# Altium project PM_Drive_UI.PrjPcb
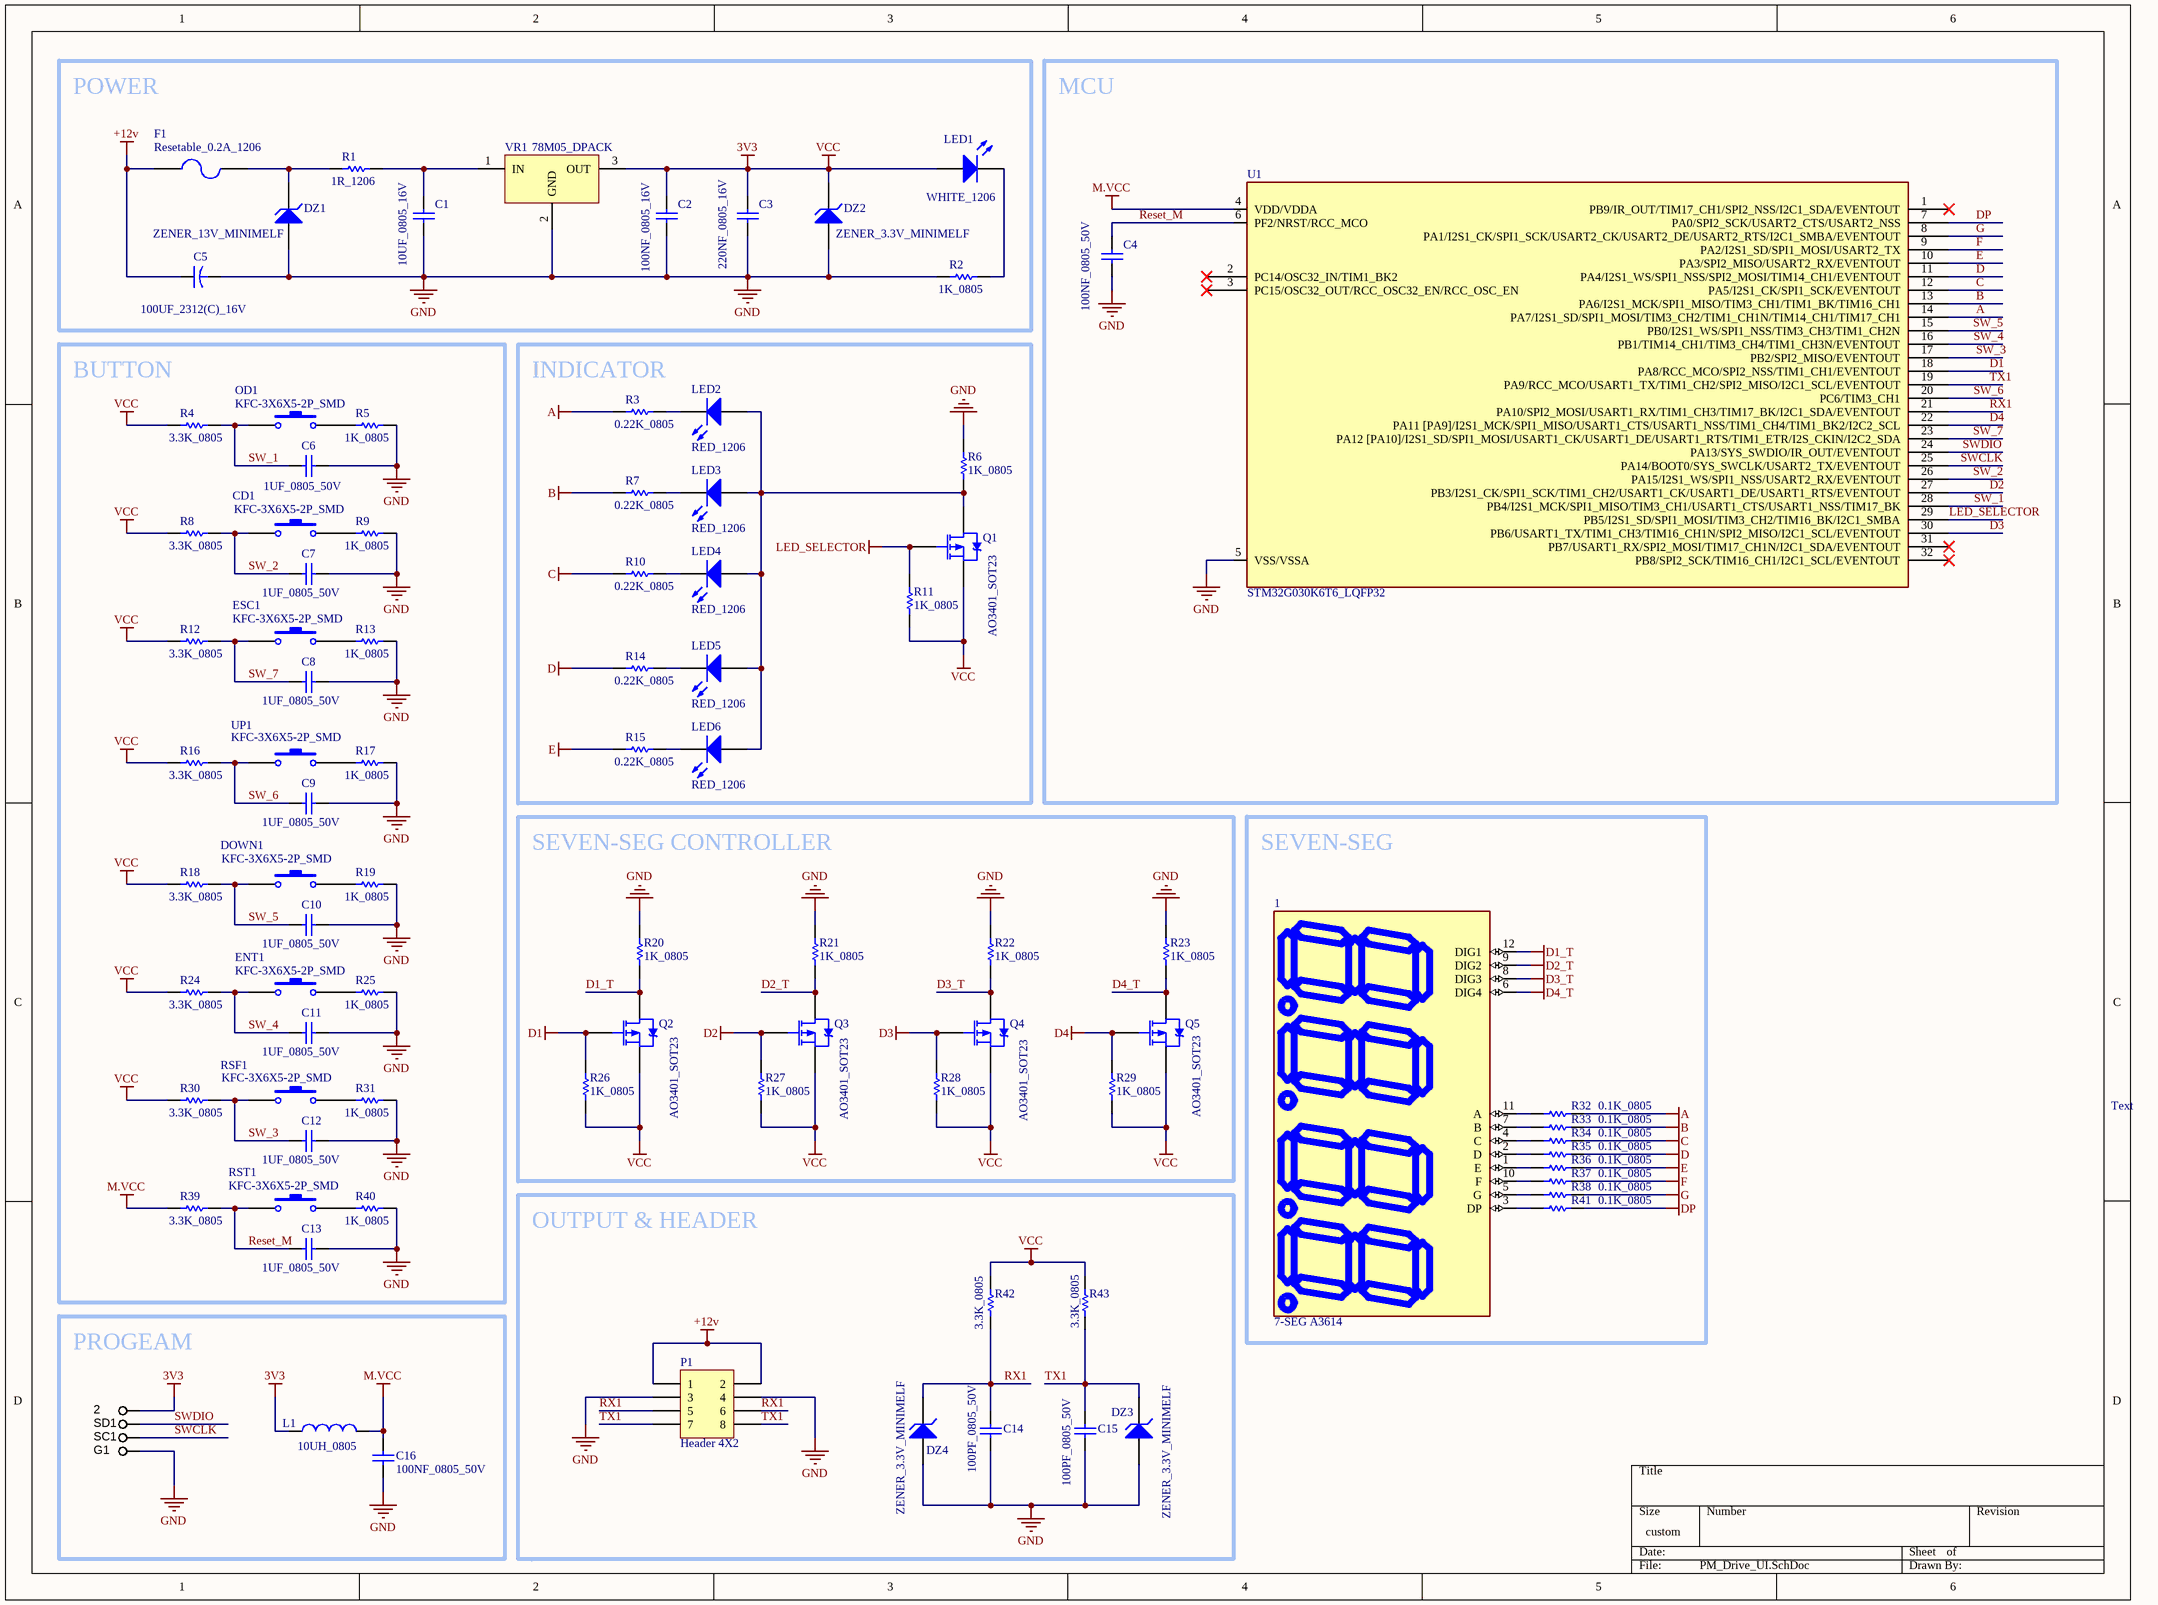
[diagram p0: PM_Drive_UI.SchDoc]
1 sheet, 92 parts. Net scope: global (net labels, ports and power ports of the same name join across sheets).
Board file: PM_Drive_UI.PcbDoc

## Sheet PM_Drive_UI.SchDoc: PM_Drive_UI
size 400 x 299 mm; Date: 1402/01/18; DrawnBy: Amirreza Salehpour

### Parts
1  7-SEG A3614  [7Seg_4Digit]
2  (no value)  [TPSMD_D1]  (net tie, no BOM)
C1  10UF_0805_16V  [Cap_0805_Nominal]
C2  100NF_0805_16V  [Cap_0805_Nominal]
C3  220NF_0805_16V  [Cap_0805_Nominal]
C4  100NF_0805_50V  [Cap_0805_Nominal]
C5  100UF_2312(C)_16V  [Cap_Tantal(6032)_C]
C6  1UF_0805_50V  [Cap_0805_Nominal]
C7  1UF_0805_50V  [Cap_0805_Nominal]
C8  1UF_0805_50V  [Cap_0805_Nominal]
C9  1UF_0805_50V  [Cap_0805_Nominal]
C10  1UF_0805_50V  [Cap_0805_Nominal]
C11  1UF_0805_50V  [Cap_0805_Nominal]
C12  1UF_0805_50V  [Cap_0805_Nominal]
C13  1UF_0805_50V  [Cap_0805_Nominal]
C14  100PF_0805_50V  [Cap_0805_Nominal]
C15  100PF_0805_50V  [Cap_0805_Nominal]
C16  100NF_0805_50V  [Cap_0805_Nominal]
CD1  KFC-3X6X5-2P_SMD  [SWPBS_SPST_6X3X5]
DOWN1  KFC-3X6X5-2P_SMD  [SWPBS_SPST_6X3X5]
DZ1  ZENER_13V_MINIMELF  [Diode_ZENER_MINIMELF]
DZ2  ZENER_3.3V_MINIMELF  [Diode_ZENER_MINIMELF]
DZ3  ZENER_3.3V_MINIMELF  [Diode_ZENER_MINIMELF]
DZ4  ZENER_3.3V_MINIMELF  [Diode_ZENER_MINIMELF]
ENT1  KFC-3X6X5-2P_SMD  [SWPBS_SPST_6X3X5]
ESC1  KFC-3X6X5-2P_SMD  [SWPBS_SPST_6X3X5]
F1  Resetable_0.2A_1206  [FUSE_1206]
G1  (no value)  [TPSMD_D1]  (net tie, no BOM)
L1  10UH_0805  [INDUCTOR_0805_Nominal]
LED1  WHITE_1206  [LED_1206_NOMINAL]
LED2  RED_1206  [LED_1206_NOMINAL]
LED3  RED_1206  [LED_1206_NOMINAL]
LED4  RED_1206  [LED_1206_NOMINAL]
LED5  RED_1206  [LED_1206_NOMINAL]
LED6  RED_1206  [LED_1206_NOMINAL]
OD1  KFC-3X6X5-2P_SMD  [SWPBS_SPST_6X3X5]
P1  Header 4X2  [HDR_M_2X4_2.54MM]
Q1  AO3401_SOT23  [SOT23_MOSFET]
Q2  AO3401_SOT23  [SOT23_MOSFET]
Q3  AO3401_SOT23  [SOT23_MOSFET]
Q4  AO3401_SOT23  [SOT23_MOSFET]
Q5  AO3401_SOT23  [SOT23_MOSFET]
R1  1R_1206  [Res_1206_BIG SIZE]
R2  1K_0805  [Res_0805_Nominal]
R3  0.22K_0805  [Res_0805_Nominal]
R4  3.3K_0805  [Res_0805_Nominal]
R5  1K_0805  [Res_0805_Nominal]
R6  1K_0805  [Res_0805_Nominal]
R7  0.22K_0805  [Res_0805_Nominal]
R8  3.3K_0805  [Res_0805_Nominal]
R9  1K_0805  [Res_0805_Nominal]
R10  0.22K_0805  [Res_0805_Nominal]
R11  1K_0805  [Res_0805_Nominal]
R12  3.3K_0805  [Res_0805_Nominal]
R13  1K_0805  [Res_0805_Nominal]
R14  0.22K_0805  [Res_0805_Nominal]
R15  0.22K_0805  [Res_0805_Nominal]
R16  3.3K_0805  [Res_0805_Nominal]
R17  1K_0805  [Res_0805_Nominal]
R18  3.3K_0805  [Res_0805_Nominal]
R19  1K_0805  [Res_0805_Nominal]
R20  1K_0805  [Res_0805_Nominal]
R21  1K_0805  [Res_0805_Nominal]
R22  1K_0805  [Res_0805_Nominal]
R23  1K_0805  [Res_0805_Nominal]
R24  3.3K_0805  [Res_0805_Nominal]
R25  1K_0805  [Res_0805_Nominal]
R26  1K_0805  [Res_0805_Nominal]
R27  1K_0805  [Res_0805_Nominal]
R28  1K_0805  [Res_0805_Nominal]
R29  1K_0805  [Res_0805_Nominal]
R30  3.3K_0805  [Res_0805_Nominal]
R31  1K_0805  [Res_0805_Nominal]
R32  0.1K_0805  [Res_0805_Nominal]
R33  0.1K_0805  [Res_0805_Nominal]
R34  0.1K_0805  [Res_0805_Nominal]
R35  0.1K_0805  [Res_0805_Nominal]
R36  0.1K_0805  [Res_0805_Nominal]
R37  0.1K_0805  [Res_0805_Nominal]
R38  0.1K_0805  [Res_0805_Nominal]
R39  3.3K_0805  [Res_0805_Nominal]
R40  1K_0805  [Res_0805_Nominal]
R41  0.1K_0805  [Res_0805_Nominal]
R42  3.3K_0805  [Res_0805_Nominal]
R43  3.3K_0805  [Res_0805_Nominal]
RSF1  KFC-3X6X5-2P_SMD  [SWPBS_SPST_6X3X5]
RST1  KFC-3X6X5-2P_SMD  [SWPBS_SPST_6X3X5]
SC1  (no value)  [TPSMD_D1]  (net tie, no BOM)
SD1  (no value)  [TPSMD_D1]  (net tie, no BOM)
U1  STM32G030K6T6_LQFP32  [QFG80_32]
UP1  KFC-3X6X5-2P_SMD  [SWPBS_SPST_6X3X5]
VR1  78M05_DPACK  [DPAK]

### Blocks framed on the sheet
POWER: C1-C3 C5 DZ1 DZ2 F1 LED1 R1 R2 VR1
MCU: C4 U1
BUTTON: C6-C13 CD1 DOWN1 ENT1 ESC1 OD1 R4 R5 R8 R9 R12 R13 R16-R19 R24 R25 R30 R31 R39 R40 RSF1 RST1 UP1
INDICATOR: LED2-LED6 Q1 R3 R6 R7 R10 R11 R14 R15
SEVEN-SEG CONTROLLER: Q2-Q5 R20-R23 R26-R29
SEVEN-SEG: 1 R32-R38 R41
OUTPUT & HEADER: C14 C15 DZ3 DZ4 P1 R42 R43
PROGEAM: 2 C16 G1 L1 SC1 SD1

### Nets
3V3: 2.1 C2.2 C3.2 DZ2.2(K) L1.1 LED1.1(A) Q1.2(S) Q2.2(S) Q3.2(S) Q4.2(S) Q5.2(S) R4.1 R8.1 R11.1 R12.1 R16.1 R18.1 R24.1 R26.1 R27.1 R28.1 R29.1 R30.1 R42.2 R43.2 VR1.3(OUT)  [also labelled VCC]
+12v: C5.1 F1.1 P1.1 P1.2
A: R3.1 R32.2 U1.14(PA7/I2S1_SD/SPI1_MOSI/TIM3_CH2/TIM1_CH1N/TIM14_CH1/TIM17_CH1)
B: R7.1 R33.2 U1.13(PA6/I2S1_MCK/SPI1_MISO/TIM3_CH1/TIM1_BK/TIM16_CH1)
C: R10.1 R34.1 U1.12(PA5/I2S1_CK/SPI1_SCK/EVENTOUT)
D: R14.1 R35.1 U1.11(PA4/I2S1_WS/SPI1_NSS/SPI2_MOSI/TIM14_CH1/EVENTOUT)
D1: Q2.1(G) R26.2 U1.18(PA8/RCC_MCO/SPI2_NSS/TIM1_CH1/EVENTOUT)
D1_T: 1.12(DIG1) Q2.3(D) R20.1
D2: Q3.1(G) R27.2 U1.27(PB3/I2S1_CK/SPI1_SCK/TIM1_CH2/USART1_CK/USART1_DE/USART1_RTS/EVENTOUT)
D2_T: 1.9(DIG2) Q3.3(D) R21.1
D3: Q4.1(G) R28.2 U1.30(PB6/USART1_TX/TIM1_CH3/TIM16_CH1N/SPI2_MISO/I2C1_SCL/EVENTOUT)
D3_T: 1.8(DIG3) Q4.3(D) R22.1
D4: Q5.1(G) R29.2 U1.22(PA11_[PA9]/I2S1_MCK/SPI1_MISO/USART1_CTS/USART1_NSS/TIM1_CH4/TIM1_BK2/I2C2_SCL)
D4_T: 1.6(DIG4) Q5.3(D) R23.1
DP: R41.1 U1.7(PA0/SPI2_SCK/USART2_CTS/USART2_NSS)
E: R15.1 R36.1 U1.10(PA3/SPI2_MISO/USART2_RX/EVENTOUT)
F: R37.2 U1.9(PA2/I2S1_SD/SPI1_MOSI/USART2_TX)
G: R38.1 U1.8(PA1/I2S1_CK/SPI1_SCK/USART2_CK/USART2_DE/USART2_RTS/I2C1_SMBA/EVENTOUT)
GND: C1.1 C2.1 C3.1 C4.1 C5.2 C6.1 C7.1 C8.1 C9.1 C10.1 C11.1 C12.1 C13.1 C14.2 C15.2 C16.2 DZ1.1(A) DZ2.1(A) DZ3.1(A) DZ4.1(A) G1.1 P1.3 P1.4 R2.1 R5.2 R6.2 R9.2 R13.2 R17.2 R19.2 R20.2 R21.2 R22.2 R23.2 R25.2 R31.2 R40.2 U1.5(VSS/VSSA) VR1.2(GND)
LED_SELECTOR: Q1.1(G) R11.2 U1.29(PB5/I2S1_SD/SPI1_MOSI/TIM3_CH2/TIM16_BK/I2C1_SMBA)
M.VCC: C16.1 L1.2 R39.1 U1.4(VDD/VDDA)
Reset_M: C4.2 C13.2 R39.2 RST1.1 U1.6(PF2/NRST/RCC_MCO)
RX1: C14.1 DZ4.2(K) P1.5 P1.6 R42.1 U1.21(PA10/SPI2_MOSI/USART1_RX/TIM1_CH3/TIM17_BK/I2C1_SDA/EVENTOUT)
SW_1: C6.2 OD1.1 R4.2 U1.28(PB4/I2S1_MCK/SPI1_MISO/TIM3_CH1/USART1_CTS/USART1_NSS/TIM17_BK)
SW_2: C7.2 CD1.1 R8.2 U1.26(PA15/I2S1_WS/SPI1_NSS/USART2_RX/EVENTOUT)
SW_3: C12.2 R30.2 RSF1.1 U1.17(PB2/SPI2_MISO/EVENTOUT)
SW_4: C11.2 ENT1.1 R24.2 U1.16(PB1/TIM14_CH1/TIM3_CH4/TIM1_CH3N/EVENTOUT)
SW_5: C10.2 DOWN1.1 R18.2 U1.15(PB0/I2S1_WS/SPI1_NSS/TIM3_CH3/TIM1_CH2N)
SW_6: C9.2 R16.2 U1.20(PC6/TIM3_CH1) UP1.1
SW_7: C8.2 ESC1.1 R12.2 U1.23(PA12_[PA10]/I2S1_SD/SPI1_MOSI/USART1_CK/USART1_DE/USART1_RTS/TIM1_ETR/I2S_CKIN/I2C2_SDA)
SWCLK: SC1.1 U1.25(PA14/BOOT0/SYS_SWCLK/USART2_TX/EVENTOUT)
SWDIO: SD1.1 U1.24(PA13/SYS_SWDIO/IR_OUT/EVENTOUT)
TX1: C15.1 DZ3.2(K) P1.7 P1.8 R43.1 U1.19(PA9/RCC_MCO/USART1_TX/TIM1_CH2/SPI2_MISO/I2C1_SCL/EVENTOUT)
Net1_1: 1.1(E) R36.2
Net1_2: 1.2(D) R35.2
Net1_3: 1.3(DP) R41.2
Net1_4: 1.4(C) R34.2
Net1_5: 1.5(G) R38.2
Net1_7: 1.7(B) R33.1
Net1_10: 1.10(F) R37.1
Net1_11: 1.11(A) R32.1
NetC1_2: C1.2 R1.2 VR1.1(IN)
NetCD1_2: CD1.2 R9.1
NetDOWN1_2: DOWN1.2 R19.1
NetDZ1_2: DZ1.2(K) F1.2 R1.1
NetENT1_2: ENT1.2 R25.1
NetESC1_2: ESC1.2 R13.1
NetLED1_2: LED1.2(K) R2.2
NetLED2_1: LED2.1(A) LED3.1(A) LED4.1(A) LED5.1(A) LED6.1(A) Q1.3(D) R6.1
NetLED2_2: LED2.2(K) R3.2
NetLED3_2: LED3.2(K) R7.2
NetLED4_2: LED4.2(K) R10.2
NetLED5_2: LED5.2(K) R14.2
NetLED6_2: LED6.2(K) R15.2
NetOD1_2: OD1.2 R5.1
NetR17_1: R17.1 UP1.2
NetR31_1: R31.1 RSF1.2
NetR40_1: R40.1 RST1.2

Not connected (* = marked no-connect by the designer): U1 1(PB9/IR_OUT/TIM17_CH1/SPI2_NSS/I2C1_SDA/EVENTOUT)* 2(PC14/OSC32_IN/TIM1_BK2)* 3(PC15/OSC32_OUT/RCC_OSC32_EN/RCC_OSC_EN)* 31(PB7/USART1_RX/SPI2_MOSI/TIM17_CH1N/I2C1_SDA/EVENTOUT)* 32(PB8/SPI2_SCK/TIM16_CH1/I2C1_SCL/EVENTOUT)*

### Notes on the sheet
- Text

### Library data of the parts
1 = 7SEG-4DIGT-12mm
2 G1 SC1 SD1 = TESTPOINT_SMD: TEST POINT; MANF: MANF; MANF_P#: MANF_P#; VALUE: VALUE
C1-C4 C6-C16 = Cap: Value: 100nF; Component ID: 000401
C5 = Cap_Electrical: value: 100UF_25V_5*5.8
CD1 DOWN1 ENT1 ESC1 OD1 RSF1 RST1 UP1 = SW-PB: Switch; Published: 24-Mar-1999; LatestRevisionDate: 17-Jul-2002; LatestRevisionNote: Re-released for DXP Platform.; PackageReference: SPST-2; Publisher: Altium Limited
DZ1-DZ4 = Diode_Zener
F1 = FUSE
L1 = Inductor: Component ID: 003143
LED1-LED6 = LED: Component ID: 000517
P1 = Header 4X2: Header, 6-Pin, Dual row; LatestRevisionDate: 17-Jul-2002; LatestRevisionNote: Re-released for DXP Platform.; Publisher: Altium Limited
Q1-Q5 = MOSFET-P: P-Channel MOSFET; Published: 8-Jun-2000; LatestRevisionDate: 17-Jul-2002; LatestRevisionNote: Re-released for DXP Platform.; PackageVersion: 1995/1996; PackageReference: E3; Publisher: Altium Limited; PackageDescription: TO, Flat Index; 3 In-Line, Axial Leads; Body Dia. 4.6mm; Lead Dia. 0.5 mm (max)
R1-R43 = RES: Value: 10K_0603; Component ID: 000091
U1 = STM32G030K6T6: MCU, STM32, Arm® Cortex®-M0+ 32-bit MCU, 32KB FLASH, 8KB SRAM, 64 MHz CPU, 2x USART, timers, ADC, comm. I/Fs, 2.0-3.6V; DESC: 64MHz, I2C, SPI, USART; MANF: ST; PARAM2: 2~3.6VCC, 64MHz, 12Bit ADC; PARAM: 32KB FLASH,8KB SRAM, -40~85°C; MANF_P#: STM32G030K6T6; PRICE: 1$; VALUE: STM32G030K6T6
VR1 = 78M05